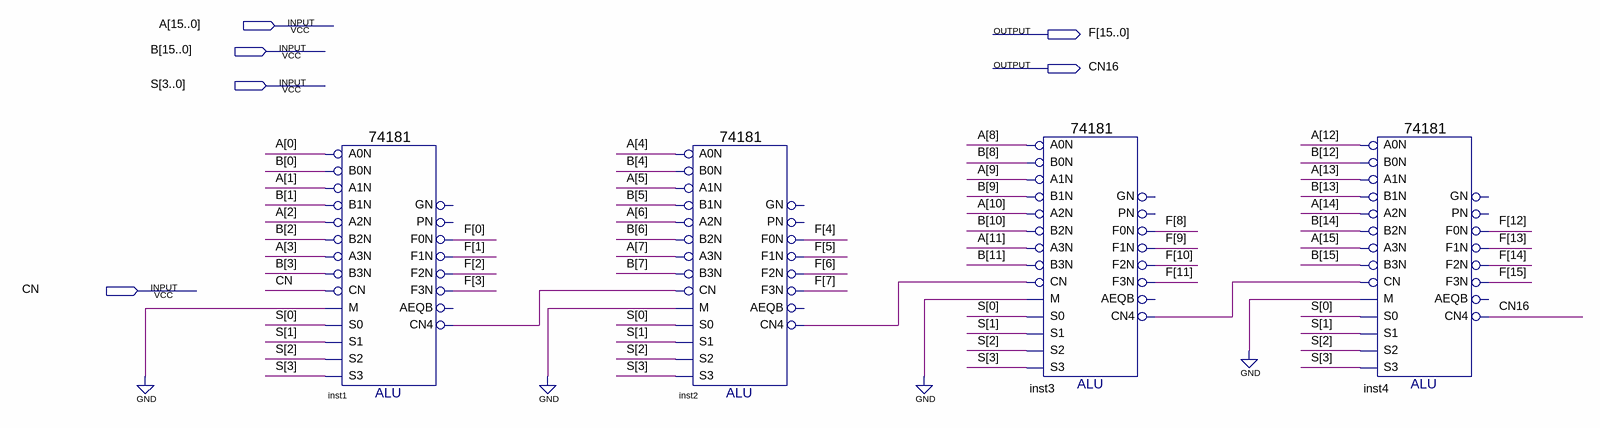
[diagram p0: schematic sheet]
// Quartus schematic ALU.bdf as structural Verilog: 4 symbols, 6 pins
module ALU (
  input  [15:0] A,
  input  [15:0] B,
  input  [3:0] S,
  input  CN,
  output [15:0] F,
  output CN16
);

  wire inst1_cn4, inst2_cn4, inst3_cn4;

  \74181  inst1 (
    .B0N(B[0]), .A0N(A[0]), .A1N(A[1]), .B1N(B[1]), .A3N(A[3]), .B2N(B[2]), .A2N(A[2]), .M(1'b0), .CN(CN),
    .B3N(B[3]), .S2(S[2]), .S1(S[1]), .S0(S[0]), .S3(S[3]), .F3N(F[3]), .F1N(F[1]), .F0N(F[0]),
    .CN4(inst1_cn4), .F2N(F[2]));  // open: PN, GN, AEQB
  \74181  inst2 (
    .B0N(B[4]), .A0N(A[4]), .A1N(A[5]), .B1N(B[5]), .A3N(A[7]), .B2N(B[6]), .A2N(A[6]), .M(1'b0),
    .CN(inst1_cn4), .B3N(B[7]), .S2(S[2]), .S1(S[1]), .S0(S[0]), .S3(S[3]), .F3N(F[7]), .F1N(F[5]),
    .F0N(F[4]), .CN4(inst2_cn4), .F2N(F[6]));  // open: PN, GN, AEQB
  \74181  inst3 (
    .B0N(B[8]), .A0N(A[8]), .A1N(A[9]), .B1N(B[9]), .A3N(A[11]), .B2N(B[10]), .A2N(A[10]), .M(1'b0),
    .CN(inst2_cn4), .B3N(B[11]), .S2(S[2]), .S1(S[1]), .S0(S[0]), .S3(S[3]), .F3N(F[11]), .F1N(F[9]),
    .F0N(F[8]), .CN4(inst3_cn4), .F2N(F[10]));  // open: PN, GN, AEQB
  \74181  inst4 (
    .B0N(B[12]), .A0N(A[12]), .A1N(A[13]), .B1N(B[13]), .A3N(A[15]), .B2N(B[14]), .A2N(A[14]), .M(1'b0),
    .CN(inst3_cn4), .B3N(B[15]), .S2(S[2]), .S1(S[1]), .S0(S[0]), .S3(S[3]), .F3N(F[15]), .F1N(F[13]),
    .F0N(F[12]), .CN4(CN16), .F2N(F[14]));  // open: PN, GN, AEQB
endmodule
